# Altium project OpenPLCv0.2.0.PrjPcb (part 3 of 3)
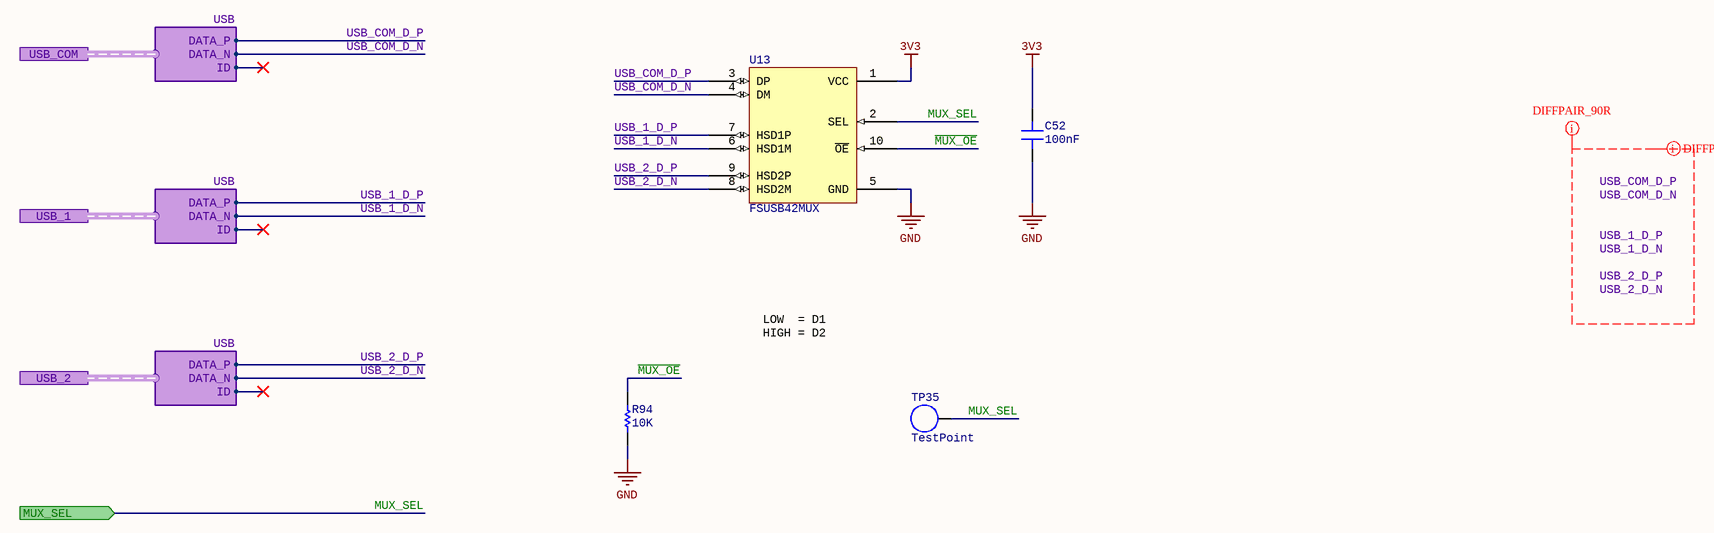
[diagram p22: OpenPLCv0.2.0_USBSwitch.SchDoc]

## Nets that join several sheets
3V3: OpenPLCv0.2.0_TopLevel (R79.1 R89.2), OpenPLCv0.2.0_ComputeModule (R43.1 R91.1), OpenPLCv0.2.0_IOController (18 pins), OpenPLCv0.2.0_ExpansionHeader (F10.1), OpenPLCv0.2.0_Watchdog (C56.2 R104.2 R107.2 U14.2), OpenPLCv0.2.0_Power (C29.2 C30.2 TP2.1 U9.3), OpenPLCv0.2.0_1Wire (5 pins), OpenPLCv0.2.0_GPIOExpander (C57.2 U15.16), OpenPLCv0.2.0_RTC (5 pins), SD_STG (9 pins), OpenPLCv0.2.0_Display (C12.2 J7.1 R116.2 R117.2), OpenPLCv0.2.0_Etherent (10 pins), SD_BOOT (9 pins), USBMUX1 (C52_1.2 U13_1.1), USBMUX2 (C52_2.2 U13_2.1)
5V: OpenPLCv0.2.0_ComputeModule (7 pins), AO1 (6 pins), AO1/LED_AO1 (R86_1.2), AO1/LED_AO2 (R86_2.2), AO2 (6 pins), AO2/LED_AO1 (R86_3.2), AO2/LED_AO2 (R86_4.2), AI/LED_AI1 (R86_5.2), AI/LED_AI2 (R86_6.2), AI/LED_AI3 (R86_7.2), AI/LED_AI4 (R86_8.2), OpenPLCv0.2.0_Power (10 pins), OpenPLCv0.2.0_1Wire (J9.1 R72.2), OpenPLCv0.2.0_RS485 (C58.2 C59.2 R76.2 U16.8), OpenPLCv0.2.0_Display (C13.2 J8.18), OpenPLCv0.2.0_USBPortTypeA (D13.2 F8.1), OpenPLCv0.2.0_SerialInterface (C51.2 U12.5)
24V: AO1 (C2_1.2 U1_1.4), AO2 (C2_2.2 U1_2.4), BO1 (Q1_1.3 R65_1.2), BO2 (Q1_2.3 R65_2.2), BO3 (Q1_3.3 R65_3.2), BO4 (Q1_4.3 R65_4.2), BO5 (Q1_5.3 R65_5.2), BO6 (Q1_6.3 R65_6.2), BO7 (Q1_7.3 R65_7.2), BO8 (Q1_8.3 R65_8.2), OpenPLCv0.2.0_Buzzer (BZR1.1 R101.2), OpenPLCv0.2.0_AnalogueInput (C63.2 U5.4), OpenPLCv0.2.0_Power (9 pins)
GND: OpenPLCv0.2.0_TopLevel (Q10.2 R92.1), OpenPLCv0.2.0_ComputeModule (55 pins), AO1 (20 pins), AO1/LED_AO1 (Q7_1.2 R88_1.1), AO1/LED_AO2 (Q7_2.2 R88_2.1), AO2 (20 pins), AO2/LED_AO1 (Q7_3.2 R88_3.1), AO2/LED_AO2 (Q7_4.2 R88_4.1), OpenPLCv0.2.0_IOController (20 pins), BO1 (5 pins), BO2 (5 pins), BO3 (5 pins), BO4 (5 pins), BO5 (5 pins), BO6 (5 pins), BO7 (5 pins), BO8 (5 pins), OpenPLCv0.2.0_Buzzer (Q8.2 R103.1), OpenPLCv0.2.0_ExpansionHeader (J23.1 J24.5 J36.5), OpenPLCv0.2.0_Watchdog (6 pins), OpenPLCv0.2.0_AnalogueInput (18 pins), AI/LED_AI1 (Q7_5.2 R88_5.1), AI/LED_AI2 (Q7_6.2 R88_6.1), AI/LED_AI3 (Q7_7.2 R88_7.1), AI/LED_AI4 (Q7_8.2 R88_8.1), OpenPLCv0.2.0_Power (32 pins), USB_UFP_STM (7 pins), OpenPLCv0.2.0_1Wire (8 pins), OpenPLCv0.2.0_GPIOExpander (5 pins), OpenPLCv0.2.0_RS485 (6 pins), OpenPLCv0.2.0_RTC (5 pins), SD_STG (C54_1.1 C55_1.1 J34_1.6), OpenPLCv0.2.0_Display (16 pins), OpenPLCv0.2.0_Etherent (C15.1 C16.1 J10.0 J10.8), SD_BOOT (C54_2.1 C55_2.1 J34_2.6), OpenPLCv0.2.0_USBPortTypeA (7 pins), OpenPLCv0.2.0_SerialInterface (C50.1 C51.1 U12.3), USBMUX1 (C52_1.1 R94_1.1 U13_1.5), USB_DFP_PI (7 pins), USBMUX2 (C52_2.1 R94_2.1 U13_2.5)
ADC_IN1: OpenPLCv0.2.0_IOController (U11.10), OpenPLCv0.2.0_AnalogueInput (R23.1 R26.1 TP13.1), AI/LED_AI1 (R87_5.2)
ADC_IN2: OpenPLCv0.2.0_IOController (U11.11), OpenPLCv0.2.0_AnalogueInput (R27.1 R30.1 TP14.1), AI/LED_AI2 (R87_6.2)
ADC_IN3: OpenPLCv0.2.0_IOController (U11.14), OpenPLCv0.2.0_AnalogueInput (R31.1 R34.1 TP15.1), AI/LED_AI3 (R87_7.2)
ADC_IN4: OpenPLCv0.2.0_IOController (U11.15), OpenPLCv0.2.0_AnalogueInput (R35.1 R38.1 TP16.1), AI/LED_AI4 (R87_8.2)
AOUT1_AO1: AO1 (D1_1.2 F1_1.1 R8_1.1 R10_1.2), AO1/LED_AO1 (R87_1.2)
AOUT1_AO2: AO2 (D1_2.2 F1_2.1 R8_2.1 R10_2.2), AO2/LED_AO1 (R87_3.2)
AOUT2_AO1: AO1 (D2_1.2 F2_1.1 R19_1.1 R22_1.2), AO1/LED_AO2 (R87_2.2)
AOUT2_AO2: AO2 (D2_2.2 F2_2.1 R19_2.1 R22_2.2), AO2/LED_AO2 (R87_4.2)
BO_EN: OpenPLCv0.2.0_IOController (U11.38), BO1 (R68_1.2 R69_1.1 TP22_1.1)
BO_EN: OpenPLCv0.2.0_IOController (U11.18), BO2 (R68_2.2 R69_2.1 TP22_2.1)
BO_EN: OpenPLCv0.2.0_IOController (U11.19), BO3 (R68_3.2 R69_3.1 TP22_3.1)
BO_EN: OpenPLCv0.2.0_IOController (U11.22), BO7 (R68_7.2 R69_7.1 TP22_7.1)
BO_EN: OpenPLCv0.2.0_IOController (U11.39), BO4 (R68_4.2 R69_4.1 TP22_4.1)
BO_EN: OpenPLCv0.2.0_IOController (U11.40), BO5 (R68_5.2 R69_5.1 TP22_5.1)
BO_EN: OpenPLCv0.2.0_IOController (U11.41), BO6 (R68_6.2 R69_6.1 TP22_6.1)
BO_EN: OpenPLCv0.2.0_IOController (U11.42), BO8 (R68_8.2 R69_8.1 TP22_8.1)
CV_CC_MODE_SEL_1: AO1 (TP4_1.1 U2_1.6), OpenPLCv0.2.0_GPIOExpander (U15.4)
CV_CC_MODE_SEL_1: AO2 (TP4_2.1 U2_2.6), OpenPLCv0.2.0_GPIOExpander (U15.6)
CV_CC_MODE_SEL_2: AO1 (TP5_1.1 U3_1.6), OpenPLCv0.2.0_GPIOExpander (U15.5)
CV_CC_MODE_SEL_2: AO2 (TP5_2.1 U3_2.6), OpenPLCv0.2.0_GPIOExpander (U15.7)
DIR: OpenPLCv0.2.0_ComputeModule (J2.38), OpenPLCv0.2.0_RS485 (J43.2 TP50.1 U16.2 U16.3)
DIR_ALT: OpenPLCv0.2.0_ExpansionHeader (J24.3), OpenPLCv0.2.0_GPIOExpander (U15.10), OpenPLCv0.2.0_RS485 (J43.1)
DSI0.CLK_N: OpenPLCv0.2.0_ComputeModule (J1.87), OpenPLCv0.2.0_Display (J7.15)
DSI0.CLK_P: OpenPLCv0.2.0_ComputeModule (J1.89), OpenPLCv0.2.0_Display (J7.14)
DSI0.D0_N: OpenPLCv0.2.0_ComputeModule (J1.75), OpenPLCv0.2.0_Display (J7.21)
DSI0.D0_P: OpenPLCv0.2.0_ComputeModule (J1.77), OpenPLCv0.2.0_Display (J7.20)
DSI0.D1_N: OpenPLCv0.2.0_ComputeModule (J1.81), OpenPLCv0.2.0_Display (J7.18)
DSI0.D1_P: OpenPLCv0.2.0_ComputeModule (J1.83), OpenPLCv0.2.0_Display (J7.17)
DSI0.D2_N: OpenPLCv0.2.0_ComputeModule (J1.93), OpenPLCv0.2.0_Display (J7.12)
DSI0.D2_P: OpenPLCv0.2.0_ComputeModule (J1.95), OpenPLCv0.2.0_Display (J7.11)
DSI0.D3_N: OpenPLCv0.2.0_ComputeModule (J1.94), OpenPLCv0.2.0_Display (J7.9)
DSI0.D3_P: OpenPLCv0.2.0_ComputeModule (J1.96), OpenPLCv0.2.0_Display (J7.8)
~{ETH_LED2}: OpenPLCv0.2.0_ComputeModule (J2.17), OpenPLCv0.2.0_Etherent (J10.11)
~{ETH_LED3}: OpenPLCv0.2.0_ComputeModule (J2.15), OpenPLCv0.2.0_Etherent (J10.10)
ETH_GB.D0_N: OpenPLCv0.2.0_ComputeModule (J2.10), OpenPLCv0.2.0_Etherent (R51.1)
ETH_GB.D0_P: OpenPLCv0.2.0_ComputeModule (J2.12), OpenPLCv0.2.0_Etherent (R50.1)
ETH_GB.D1_N: OpenPLCv0.2.0_ComputeModule (J2.6), OpenPLCv0.2.0_Etherent (R53.1)
ETH_GB.D1_P: OpenPLCv0.2.0_ComputeModule (J2.4), OpenPLCv0.2.0_Etherent (R52.1)
EXP_GPIO5: OpenPLCv0.2.0_Power (R62.2 R73.1 TP3.1), OpenPLCv0.2.0_GPIOExpander (U15.9)
EXP_GPIO7: OpenPLCv0.2.0_ExpansionHeader (J24.4), OpenPLCv0.2.0_GPIOExpander (U15.11)
EXP_GPIO8: OpenPLCv0.2.0_ExpansionHeader (J36.1), OpenPLCv0.2.0_GPIOExpander (U15.12)
GPIO2: OpenPLCv0.2.0_ComputeModule (J2.58), OpenPLCv0.2.0_ExpansionHeader (J22.2), OpenPLCv0.2.0_RTC (R115.1 U6.5)
GPIO3: OpenPLCv0.2.0_ComputeModule (J2.56), OpenPLCv0.2.0_ExpansionHeader (J22.3), OpenPLCv0.2.0_RTC (R114.1 U6.6)
GPIO4: OpenPLCv0.2.0_ComputeModule (J2.54), OpenPLCv0.2.0_IOController (R118.1 U11.30), OpenPLCv0.2.0_RS485 (J42.1)
GPIO5: OpenPLCv0.2.0_ComputeModule (J2.34), OpenPLCv0.2.0_IOController (R119.1 U11.31), OpenPLCv0.2.0_RS485 (J41.1)
GPIO7: OpenPLCv0.2.0_ComputeModule (J2.37), OpenPLCv0.2.0_IOController (R58.2)
GPIO8: OpenPLCv0.2.0_ComputeModule (J2.39), OpenPLCv0.2.0_RS485 (J42.2 R77.2 TP49.1 U16.1)
GPIO9: OpenPLCv0.2.0_ComputeModule (J2.40), OpenPLCv0.2.0_RS485 (J41.2 TP48.1 U16.4)
GPIO10: OpenPLCv0.2.0_ComputeModule (J2.44), OpenPLCv0.2.0_IOController (R64.2)
GPIO12: OpenPLCv0.2.0_ComputeModule (J2.31), OpenPLCv0.2.0_ExpansionHeader (J22.4)
GPIO13: OpenPLCv0.2.0_ComputeModule (J2.28), OpenPLCv0.2.0_ExpansionHeader (J22.5)
GPIO14: OpenPLCv0.2.0_ComputeModule (J2.55), OpenPLCv0.2.0_SerialInterface (TP27.1 U12.6)
GPIO15: OpenPLCv0.2.0_ComputeModule (J2.51), OpenPLCv0.2.0_SerialInterface (TP28.1 U12.7)
GPIO16: OpenPLCv0.2.0_ComputeModule (J2.29), OpenPLCv0.2.0_ExpansionHeader (J24.2)
GPIO17: OpenPLCv0.2.0_ComputeModule (J2.50), OpenPLCv0.2.0_ExpansionHeader (J24.1)
GPIO18: OpenPLCv0.2.0_ComputeModule (J2.49), OpenPLCv0.2.0_ExpansionHeader (J23.5)
GPIO19: OpenPLCv0.2.0_ComputeModule (J2.26), OpenPLCv0.2.0_ExpansionHeader (J23.3)
GPIO20: OpenPLCv0.2.0_ComputeModule (J2.27), OpenPLCv0.2.0_ExpansionHeader (J23.2)
GPIO21: OpenPLCv0.2.0_ComputeModule (J2.25), OpenPLCv0.2.0_ExpansionHeader (R121.1)
GPIO22: OpenPLCv0.2.0_ComputeModule (J2.46), SD_STG (R120_1.2)
GPIO23: OpenPLCv0.2.0_ComputeModule (J2.47), SD_STG (J34_1.3 R95_1.1)
GPIO24: OpenPLCv0.2.0_ComputeModule (J2.45), SD_STG (J34_1.7 R97_1.1)
GPIO25: OpenPLCv0.2.0_ComputeModule (J2.41), SD_STG (J34_1.8 R98_1.1)
GPIO26: OpenPLCv0.2.0_ComputeModule (J2.24), SD_STG (J34_1.1 R99_1.1)
GPIO27: OpenPLCv0.2.0_ComputeModule (J2.48), SD_STG (J34_1.2 R100_1.1)
HDMI.CEC: OpenPLCv0.2.0_ComputeModule (J1.51), OpenPLCv0.2.0_Display (J8.13)
HDMI.CLK_N: OpenPLCv0.2.0_ComputeModule (J1.90), OpenPLCv0.2.0_Display (J8.12)
HDMI.CLK_P: OpenPLCv0.2.0_ComputeModule (J1.88), OpenPLCv0.2.0_Display (J8.10)
HDMI.D0_N: OpenPLCv0.2.0_ComputeModule (J1.84), OpenPLCv0.2.0_Display (J8.9)
HDMI.D0_P: OpenPLCv0.2.0_ComputeModule (J1.82), OpenPLCv0.2.0_Display (J8.7)
HDMI.D1_N: OpenPLCv0.2.0_ComputeModule (J1.78), OpenPLCv0.2.0_Display (J8.6)
HDMI.D1_P: OpenPLCv0.2.0_ComputeModule (J1.76), OpenPLCv0.2.0_Display (J8.4)
HDMI.D2_N: OpenPLCv0.2.0_ComputeModule (J1.72), OpenPLCv0.2.0_Display (J8.3)
HDMI.D2_P: OpenPLCv0.2.0_ComputeModule (J1.70), OpenPLCv0.2.0_Display (J8.1)
HDMI.HPD: OpenPLCv0.2.0_ComputeModule (J1.53), OpenPLCv0.2.0_Display (J8.19)
HDMI.SCL: OpenPLCv0.2.0_ComputeModule (J1.100), OpenPLCv0.2.0_Display (J8.15)
HDMI.SDA: OpenPLCv0.2.0_ComputeModule (J1.99), OpenPLCv0.2.0_Display (J8.16)
I2C0.SCL: OpenPLCv0.2.0_ComputeModule (J2.80), OpenPLCv0.2.0_Display (J7.3 R116.1)
I2C0.SDA: OpenPLCv0.2.0_ComputeModule (J2.82), OpenPLCv0.2.0_Display (J7.2 R117.1)
I2C.SCL: OpenPLCv0.2.0_IOController (R81.1 U11.45), OpenPLCv0.2.0_ExpansionHeader (J37.4), OpenPLCv0.2.0_1Wire (U7.4), OpenPLCv0.2.0_GPIOExpander (TP47.1 U15.14)
I2C.SDA: OpenPLCv0.2.0_IOController (R82.1 U11.46), OpenPLCv0.2.0_ExpansionHeader (J37.3), OpenPLCv0.2.0_1Wire (U7.5), OpenPLCv0.2.0_GPIOExpander (TP46.1 U15.15)
I2S_DAC_BCK: OpenPLCv0.2.0_TopLevel (TP7.1), AO1 (U4_1.1), OpenPLCv0.2.0_IOController (U11.17)
I2S_DAC_BCK: OpenPLCv0.2.0_TopLevel (TP21.1), AO2 (U4_2.1), OpenPLCv0.2.0_IOController (U11.20)
I2S_DAC_DIN: OpenPLCv0.2.0_TopLevel (TP9.1), AO1 (U4_1.3), AO2 (U4_2.3), OpenPLCv0.2.0_IOController (U11.25)
I2S_DAC_WS: OpenPLCv0.2.0_TopLevel (TP8.1), AO1 (U4_1.2), AO2 (U4_2.2), OpenPLCv0.2.0_IOController (U11.29)
~{INT}: OpenPLCv0.2.0_IOController (U11.16), OpenPLCv0.2.0_GPIOExpander (U15.13)
LED: OpenPLCv0.2.0_IOController (R84.2 U11.2), OpenPLCv0.2.0_Watchdog (TP44.1 U14.6)
MCU_SPI_MISO: OpenPLCv0.2.0_IOController (U11.27), OpenPLCv0.2.0_ExpansionHeader (J36.3)
MCU_SPI_MOSI: OpenPLCv0.2.0_IOController (U11.28), OpenPLCv0.2.0_ExpansionHeader (J36.2)
MCU_UART_RX: OpenPLCv0.2.0_IOController (U11.13), OpenPLCv0.2.0_ExpansionHeader (J37.2)
MCU_UART_TX: OpenPLCv0.2.0_IOController (U11.12), OpenPLCv0.2.0_ExpansionHeader (J37.1)
MUX_SEL: OpenPLCv0.2.0_TopLevel (J11.2 Q10.1), OpenPLCv0.2.0_ComputeModule (J2.93), USBMUX1 (TP35_1.1 U13_1.2), USBMUX2 (TP35_2.1 U13_2.2)
PWM9: OpenPLCv0.2.0_IOController (U11.43), OpenPLCv0.2.0_Buzzer (R102.1 R103.2 TP42.1)
~{RESET}: OpenPLCv0.2.0_ComputeModule (J2.92), OpenPLCv0.2.0_IOController (R80.1 TP26.1 U11.7), OpenPLCv0.2.0_Watchdog (D24.3 D25.3)
SD_CLK: OpenPLCv0.2.0_ComputeModule (J2.57), SD_BOOT (R120_2.2)
SD_CMD: OpenPLCv0.2.0_ComputeModule (J2.62), SD_BOOT (J34_2.3 R95_2.1)
SD_DAT0: OpenPLCv0.2.0_ComputeModule (J2.63), SD_BOOT (J34_2.7 R97_2.1)
SD_DAT1: OpenPLCv0.2.0_ComputeModule (J2.67), SD_BOOT (J34_2.8 R98_2.1)
SD_DAT2: OpenPLCv0.2.0_ComputeModule (J2.69), SD_BOOT (J34_2.1 R99_2.1)
SD_DAT3: OpenPLCv0.2.0_ComputeModule (J2.61), SD_BOOT (J34_2.2 R100_2.1)
SPI2_SCK: OpenPLCv0.2.0_IOController (U11.26), OpenPLCv0.2.0_ExpansionHeader (R122.1)
STM_UART3.TX: OpenPLCv0.2.0_IOController (U11.21), OpenPLCv0.2.0_1Wire (8 pins)
STM_USB_MCU.DATA_N: OpenPLCv0.2.0_IOController (U11.32), USB_UFP_STM (J33_1.2)
STM_USB_MCU.DATA_P: OpenPLCv0.2.0_IOController (U11.33), USB_UFP_STM (J33_1.3)
USB.DATA_N: OpenPLCv0.2.0_USBPortTypeA (J15.2), USBMUX1 (U13_1.6)
USB.DATA_N: USB_DFP_PI (J33_2.2), USBMUX2 (U13_2.4)
USB.DATA_P: OpenPLCv0.2.0_USBPortTypeA (J15.3), USBMUX1 (U13_1.7)
USB.DATA_P: USB_DFP_PI (J33_2.3), USBMUX2 (U13_2.3)
USB_1_D_N: USBMUX1 (U13_1.8), USBMUX2 (U13_2.6)
USB_1_D_P: USBMUX1 (U13_1.9), USBMUX2 (U13_2.7)
USB_2_D_N: OpenPLCv0.2.0_SerialInterface (U12.2), USBMUX2 (U13_2.8)
USB_2_D_P: OpenPLCv0.2.0_SerialInterface (U12.1), USBMUX2 (U13_2.9)
USB_COM_D_N: OpenPLCv0.2.0_ComputeModule (J1.3), USBMUX1 (U13_1.4)
USB_COM_D_P: OpenPLCv0.2.0_ComputeModule (J1.5), USBMUX1 (U13_1.3)
USB_OTG.ID: OpenPLCv0.2.0_TopLevel (Q10.3 R79.2), OpenPLCv0.2.0_ComputeModule (J1.1)

## Assembly variants
Basic: all parts fitted